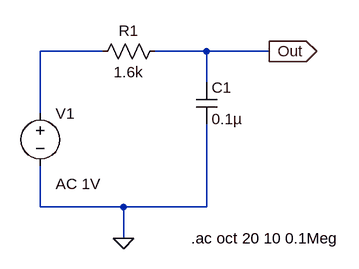
[diagram p0: schematic 25.1_3.(2).asc]
25.1_3.(2).asc, the LTspice schematic file:
Version 4
SHEET 1 880 680
WIRE 16 96 -80 96
WIRE 176 96 96 96
WIRE 272 96 176 96
WIRE 176 144 176 96
WIRE -80 192 -80 96
WIRE -80 336 -80 272
WIRE 48 336 -80 336
WIRE 176 336 176 208
WIRE 176 336 48 336
WIRE 48 384 48 336
FLAG 48 384 0
FLAG 272 96 Out
IOPIN 272 96 Out
SYMBOL cap 160 144 R0
SYMATTR InstName C1
SYMATTR Value 0.1µ
SYMBOL res 112 80 R90
WINDOW 0 0 56 VBottom 2
WINDOW 3 32 56 VTop 2
SYMATTR InstName R1
SYMATTR Value 1.6k
SYMBOL voltage -80 176 R0
WINDOW 123 24 124 Left 2
WINDOW 39 0 0 Left 2
SYMATTR InstName V1
SYMATTR Value ""
SYMATTR Value2 AC 1V
TEXT 152 384 Left 2 !.ac oct 20 10 0.1Meg

The netlist it stands for:
* 25.1_3.(2).asc
C1 Out 0 0.1µ
R1 Out N001 1.6k
V1 N001 0 AC 1V
.ac oct 20 10 0.1Meg
.backanno
.end

* Results of the author's LTspice run, read from the files saved beside the schematic
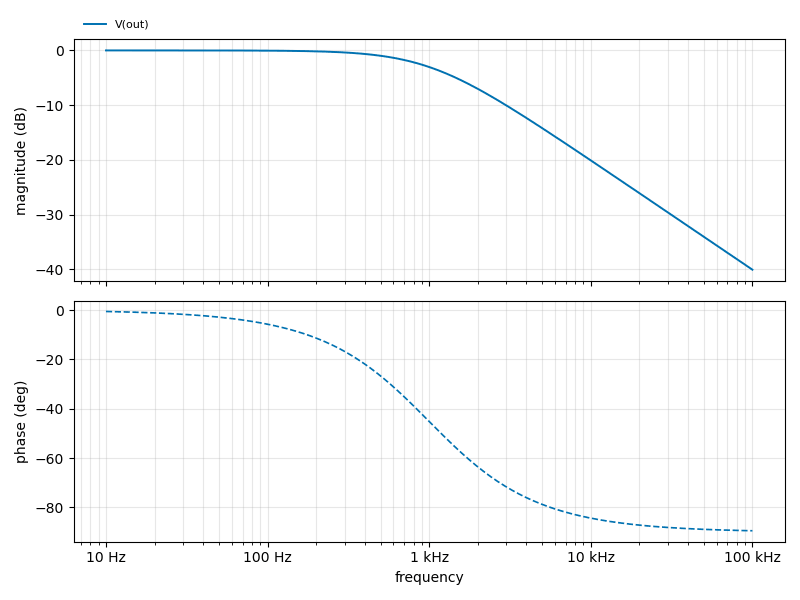
[diagram p1: AC Analysis of 25.1_3.(2).asc, plotted from the saved traces]
* AC Analysis, 1 run:
*   V(out): -0.00 dB at 10 Hz, -40.05 dB at 100 kHz, peak -0.00 dB at 10 Hz, 3 dB below the peak at 994.7 Hz